# EAGLE design ESP32_adapter_revB (EAGLE 7.3.0)
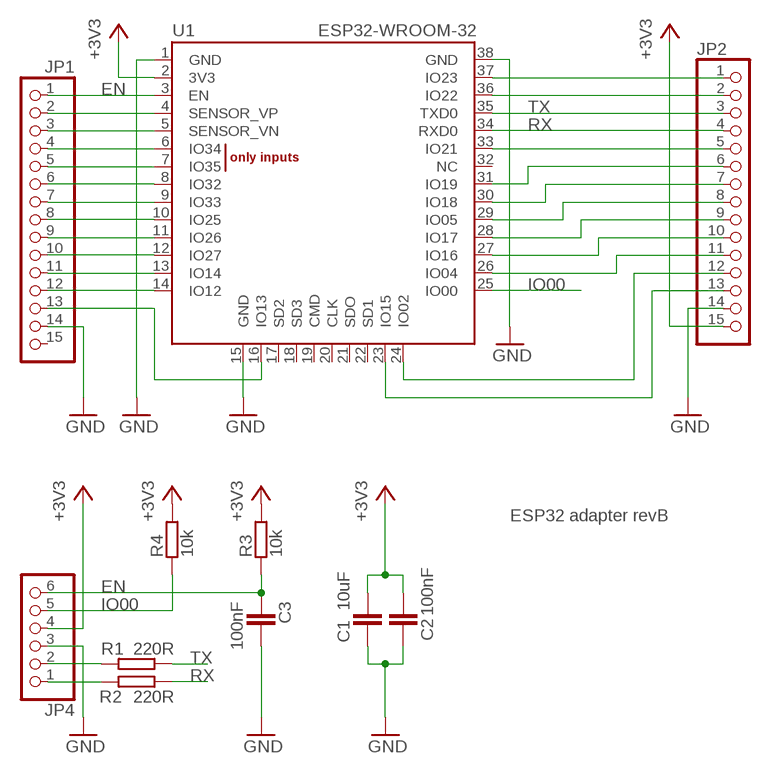
[diagram p0: schematic, sheet 1]

## Parts
C1  10uF  C-CERAMIC'SMD'  [C0805]
C2  100nF  C-CERAMIC'SMD'  [C0805]
C3  100nF  C-CERAMIC'SMD'  [C0805]
JP1  PINHD-1X15  [1X15]
JP2  PINHD-1X15  [1X15]
JP4  PINHD-1X6  [1X06]
R1  220R  R'2'  [R0805]
R2  220R  R'2'  [R0805]
R3  10k  R'2'  [R0805]
R4  10k  R'2'  [R0805]
U1  ESP-WROOM-32  [ESP-WROOM-32]

## Nets
+3V3: C1.2 C2.2 JP2.15 JP4.4 R3.2 R4.2 U1.2(3V3)
EN: C3.1 JP1.1 JP4.6 R3.1 U1.3(EN)
GND: C1.1 C2.1 C3.2 JP1.14 JP2.14 JP4.3 U1.1(GND) U1.15(GND) U1.38(GND)
IO00: JP4.5 R4.1 U1.25(IO00)
N$1: JP4.1 R2.1
N$2: JP4.2 R1.1
N$3: JP1.2 U1.4(SENSOR_VP)
N$4: JP1.3 U1.5(SENSOR_VN)
N$5: JP1.4 U1.6(IO34)
N$6: JP1.5 U1.7(IO35)
N$7: JP1.6 U1.8(IO32)
N$8: JP1.7 U1.9(IO33)
N$9: JP1.8 U1.10(IO25)
N$10: JP1.9 U1.11(IO26)
N$11: JP1.10 U1.12(IO27)
N$12: JP1.11 U1.13(IO14)
N$13: JP1.12 U1.14(IO12)
N$15: JP2.1 U1.37(IO23)
N$16: JP2.2 U1.36(IO22)
N$19: JP2.5 U1.33(IO21)
N$20: JP2.6 U1.31(IO19)
N$21: JP2.7 U1.30(IO18)
N$22: JP2.8 U1.29(IO05)
N$23: JP2.9 U1.28(IO17)
N$24: JP2.10 U1.27(IO16)
N$25: JP2.11 U1.26(IO04)
N$26: JP2.12 U1.24(IO02)
N$27: JP2.13 U1.23(IO15)
N$28: JP1.13 U1.16(IO13)
RX: JP2.4 R2.2 U1.34(RXD0)
TX: JP2.3 R1.2 U1.35(TXD0)
Unconnected: JP1.15 U1.17(SD2) U1.18(SD3) U1.19(CMD) U1.20(CLK) U1.21(SDO) U1.22(SD1) U1.32(NC)

## Notes on the sheet
- ESP32 adapter revB

## Library data of the parts
C1-C3 = 1_domaci:C-CERAMIC
JP1 JP2 = 1_domaci:PINHD-1X15: PIN HEADER
JP4 = 1_domaci:PINHD-1X6: PIN HEADER
R1-R4 = 1_domaci:R
U1 = 1_domaci:ESP-WROOM-32

## Board
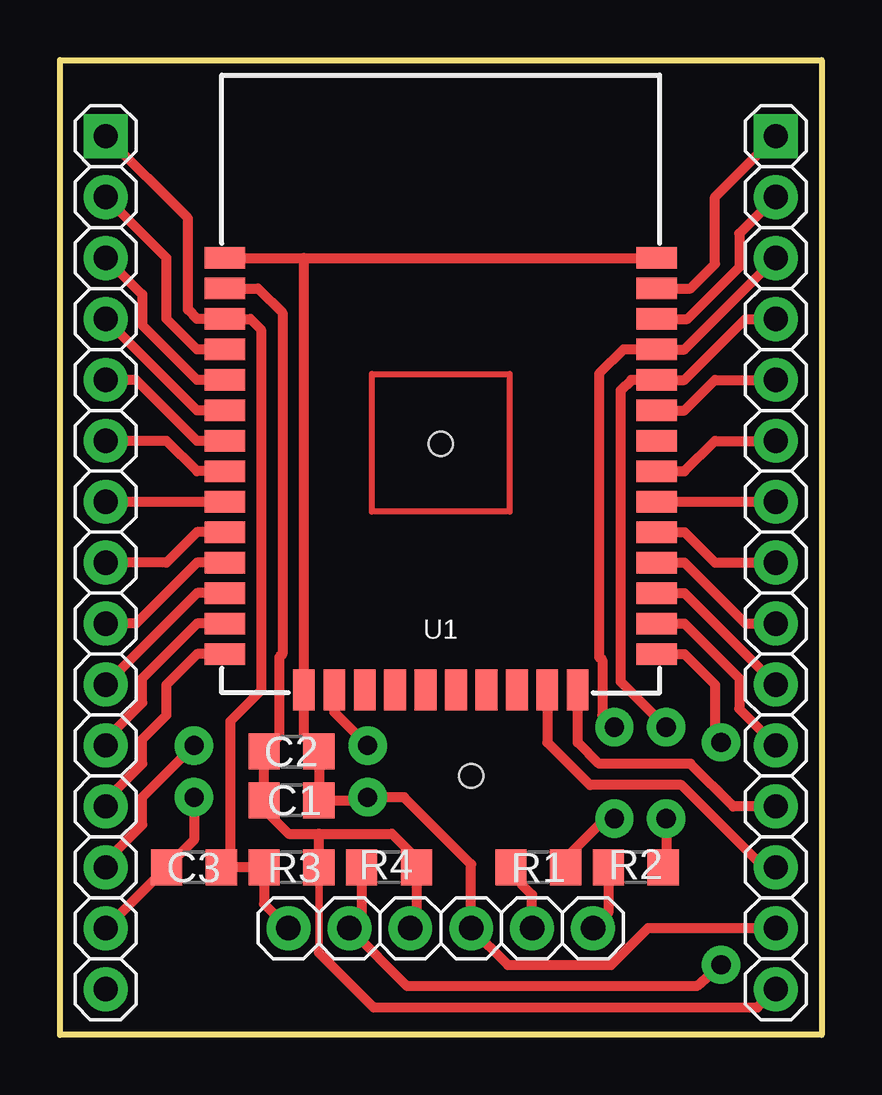
[diagram p1: board, top side]
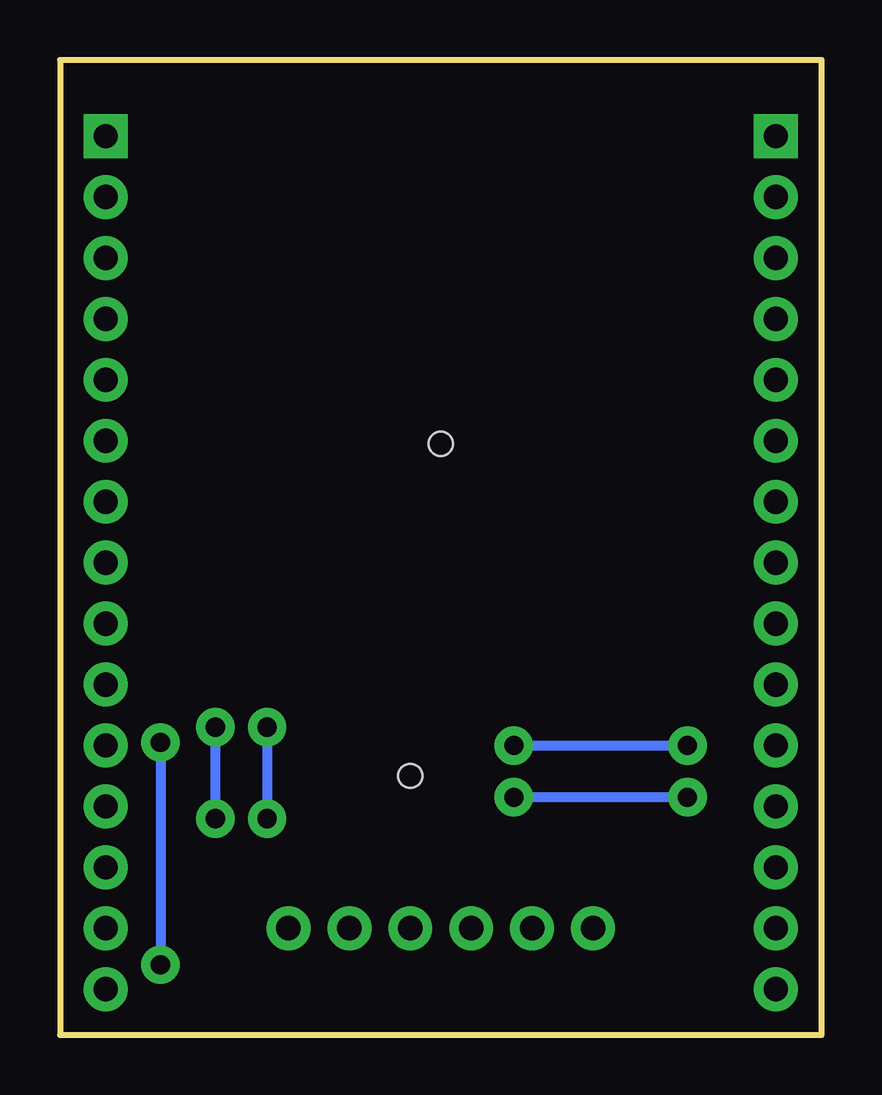
[diagram p2: board, bottom side, seen from below]

Size 31.75 x 40.64 mm. Coordinates in mm from the lower left corner, seen from the top.
Outline: 0,40.64 31.75,40.64 31.75,0 0,0 0,40.64
Copper layers (1*16): Top 0.035mm / dielectric 1.5mm / Bottom 0.035mm
Design rules "default *": minimum track width 10mil, minimum drill 24mil, track to track 8mil, track to pad 8mil, pad to pad 8mil, via to via 8mil, smd to smd 8mil, copper to edge 40mil, drill to drill 8mil, minimum pad ring 10mil, minimum via ring 8mil, stop-mask expansion 4mil, vias tented up to drill 0mil, thermal gap 10mil
Holes 1 mm at 15.88,24.64 17.14,10.79

### Footprints (pad centres in the part's own frame; a part is rotated, then mirrored left to right if it is on the bottom)
C0805 = smd 1.3 x 1.5: 1 -1.143,0; 2 1.143,0
1X15 = drill 1.016 square: 1 -17.78,0 | drill 1.016: 2 -15.24,0; 3 -12.7,0; 4 -10.16,0; 5 -7.62,0; 6 -5.08,0; 7 -2.54,0; 8 0,0; 9 2.54,0; 10 5.08,0; 11 7.62,0; 12 10.16,0; 13 12.7,0; 14 15.24,0; 15 17.78,0
1X06 = drill 1.016: 1 -6.35,0; 2 -3.81,0; 3 -1.27,0; 4 1.27,0; 5 3.81,0; 6 6.35,0
R0805 = smd 1.3 x 1.5: 1 -1.143,0; 2 1.143,0
ESP-WROOM-32 = smd 0.9 x 1.7: 1 7.7,9; 2 6.43,9; 3 5.16,9; 4 3.89,9; 5 2.62,9; 6 1.35,9; 7 0.08,9; 8 -1.19,9; 9 -2.46,9; 10 -3.73,9; 11 -5,9; 12 -6.27,9; 13 -7.54,9; 14 -8.81,9; 25 -8.81,-9; 26 -7.54,-9; 27 -6.27,-9; 28 -5,-9; 29 -3.73,-9; 30 -2.46,-9; 31 -1.19,-9; 32 0.08,-9; 33 1.35,-9; 34 2.62,-9; 35 3.89,-9; 36 5.16,-9; 37 6.43,-9; 38 7.7,-9 | smd 1.7 x 0.9: 15 -10.3,5.715; 16 -10.3,4.445; 17 -10.3,3.175; 18 -10.3,1.905; 19 -10.3,0.635; 20 -10.3,-0.635; 21 -10.3,-1.905; 22 -10.3,-3.175; 23 -10.3,-4.445; 24 -10.3,-5.715

### Placement (x,y rotation side)
C1  9.65,9.78 180 top
C2  9.65,11.81 180 top
C3  5.59,6.99 180 top
JP1  1.9,19.69 270 top
JP2  29.84,19.69 270 top
JP4  15.88,4.45 180 top
R1  19.94,6.99 0 top
R2  24,6.99 0 top
R3  9.65,6.99 0 top
R4  13.72,6.99 0 top
U1  15.88,24.68 90 top

### Tracks (layer width: path | path; a pad name or v marks a point on that pad's centre or on a via)
+3V3
  Top 0.305: 10.8,3.43 R3.2
  Top 0.406: U1.2 8.25,31.11 9.27,30.1 9.27,15.88 9.14,15.75 9.14,12.45 C2.2 C1.2 8.51,9.4 9.52,8.38 10.8,8.38 | 10.8,3.43 13.08,1.14 29.08,1.14 JP2.15 | 10.8,8.38 13.84,8.38 14.86,7.37 R4.2 14.86,4.7 JP4.4 | R3.2 10.8,8.38
EN
  Top 0.406: JP4.6 8.51,5.46 R3.1 C3.1 7.11,7.37 7.11,13.08 8.38,14.35 8.38,29.4 7.94,29.84 U1.3 5.71,29.84 5.33,30.23 5.33,34.04 JP1.1
GND  (via drill 0.8)
  Top 0.406: U1.1 10.16,32.38 | 10.16,32.38 U1.38 | 10.16,32.38 U1.15 10.16,12.45 C2.1 C1.1 12.7,9.78 v12.83,9.91 14.35,9.91 17.14,7.11 JP4.3 18.67,2.92 22.99,2.92 24.51,4.45 JP2.14 | JP1.14 C3.2 5.59,8.13 v5.59,9.91
  Bottom 0.406: v5.59,9.91 v12.83,9.91
IO00  (via drill 0.8)
  Top 0.406: v27.56,2.92 26.54,2.03 14.48,2.03 JP4.5 12.57,4.95 R4.1 | U1.25 26.03,15.88 27.3,14.6 27.3,12.45 v27.56,12.19
  Bottom 0.406: v27.56,12.19 v27.56,2.92
N$1
  Top 0.406: R2.1 22.86,5.08 JP4.1
N$2
  Top 0.406: JP4.2 19.68,5.84 18.8,6.73 R1.1
N$3
  Top 0.406: U1.4 5.71,28.57 4.45,29.84 4.45,32.38 JP1.2
N$4
  Top 0.406: U1.5 5.71,27.3 3.43,29.59 3.43,30.86 JP1.3
N$5
  Top 0.406: JP1.4 5.71,26.03 U1.6
N$6
  Top 0.406: U1.7 5.71,24.77 3.17,27.3 JP1.5
N$7
  Top 0.406: U1.8 5.71,23.49 4.45,24.77 JP1.6
N$8
  Top 0.406: JP1.7 U1.9
N$9
  Top 0.406: U1.10 5.71,20.95 4.45,19.69 JP1.8
N$10
  Top 0.406: U1.11 5.71,19.69 3.17,17.15 JP1.9
N$11
  Top 0.406: U1.12 5.71,18.41 JP1.10
N$12
  Top 0.406: JP1.11 1.9,12.32 3.43,13.84 3.43,14.86 5.71,17.15 U1.13
N$13
  Top 0.406: U1.14 5.71,15.88 4.45,14.6 4.45,13.33 3.43,12.32 3.43,11.3 1.9,9.78 JP1.12
N$15
  Top 0.406: U1.37 26.29,31.11 27.3,32.13 27.3,34.92 JP2.1
N$16
  Top 0.406: U1.36 26.16,29.84 28.32,32 28.32,33.4 JP2.2
N$19
  Top 0.406: U1.33 26.03,26.03 27.3,27.3 JP2.5
N$20
  Top 0.406: U1.31 26.03,23.49 27.3,24.77 JP2.6
N$21
  Top 0.406: U1.30 JP2.7
N$22
  Top 0.406: U1.29 26.03,20.95 27.3,19.69 JP2.8
N$23
  Top 0.406: U1.28 26.03,19.69 28.57,17.15 JP2.9
N$24
  Top 0.406: U1.27 26.03,18.41 JP2.10
N$25
  Top 0.406: U1.26 26.03,17.15 28.32,14.86 28.32,13.59 JP2.11
N$26
  Top 0.406: U1.24 21.59,12.19 22.48,11.3 26.29,11.3 28.07,9.53 JP2.12
N$27
  Top 0.406: U1.23 20.32,12.19 22.1,10.41 25.91,10.41 29.34,6.99 JP2.13
N$28  (via drill 0.8)
  Top 0.406: JP1.13 1.9,7.24 3.43,8.76 3.43,9.91 v5.59,12.06 | U1.16 11.43,13.46 v12.83,12.06
  Bottom 0.406: v12.83,12.06 v5.59,12.06
RX  (via drill 0.8)
  Top 0.406: JP2.4 28.57,29.84 26.03,27.3 U1.34 23.81,27.3 23.37,26.86 23.37,14.73 v25.27,12.83 | v25.27,9.02 25.27,7.11 R2.2
  Bottom 0.406: v25.27,12.83 v25.27,9.02
TX  (via drill 0.8)
  Top 0.406: JP2.3 26.03,28.57 U1.35 23.49,28.57 22.48,27.56 22.48,15.75 22.61,15.62 22.61,13.33 v23.11,12.83 | v23.11,9.02 22.73,9.02 21.08,7.37 R1.2
  Bottom 0.406: v23.11,12.83 v23.11,9.02